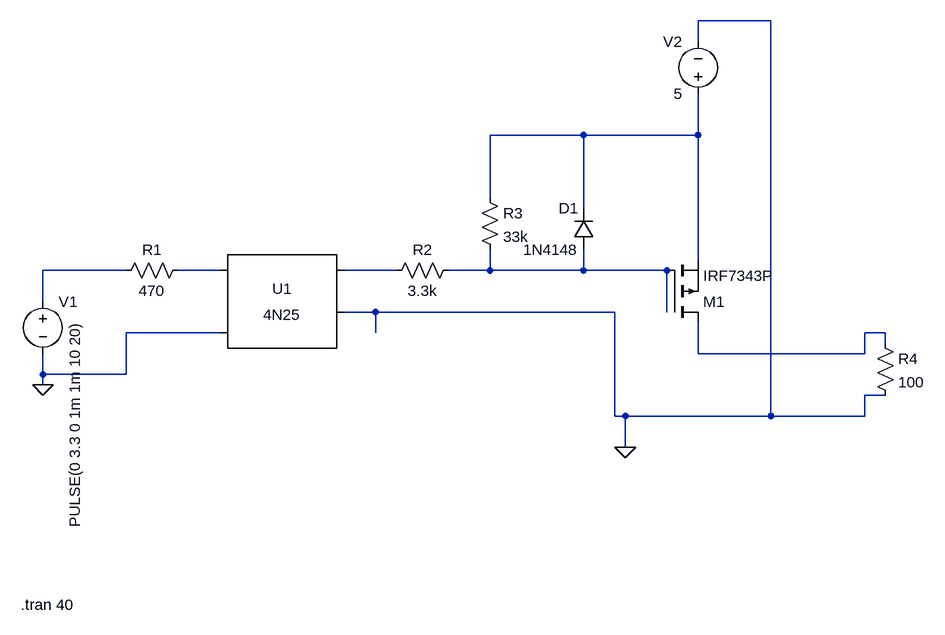
[diagram p0: schematic Draft5.asc]
Draft5.asc, the LTspice schematic file:
Version 4
SHEET 1 1136 680
WIRE 880 -272 768 -272
WIRE 768 -240 768 -272
WIRE 592 -96 448 -96
WIRE 768 -96 768 -160
WIRE 768 -96 592 -96
WIRE 448 0 448 -96
WIRE 592 16 592 -96
WIRE 768 96 768 -96
WIRE -112 112 -240 112
WIRE 32 112 -32 112
WIRE 304 112 224 112
WIRE 448 112 448 80
WIRE 448 112 384 112
WIRE 592 112 592 80
WIRE 592 112 448 112
WIRE 720 112 592 112
WIRE -240 160 -240 112
WIRE 272 176 224 176
WIRE 640 176 272 176
WIRE 720 176 720 112
WIRE 32 208 -112 208
WIRE 272 208 272 176
WIRE 1056 208 1024 208
WIRE 1056 224 1056 208
WIRE 768 240 768 192
WIRE 1024 240 1024 208
WIRE 1024 240 768 240
WIRE -240 272 -240 240
WIRE -112 272 -112 208
WIRE -112 272 -240 272
WIRE -240 288 -240 272
WIRE 1056 304 1024 304
WIRE 640 336 640 176
WIRE 656 336 640 336
WIRE 880 336 880 -272
WIRE 880 336 656 336
WIRE 1024 336 1024 304
WIRE 1024 336 880 336
WIRE 656 384 656 336
FLAG -240 288 0
FLAG 656 384 0
SYMBOL Optos\\4N25 128 176 R0
SYMATTR InstName U1
SYMBOL voltage -240 144 R0
WINDOW 3 49 46 VRight 2
WINDOW 123 0 0 Left 0
WINDOW 39 0 0 Left 0
SYMATTR InstName V1
SYMATTR Value PULSE(0 3.3 0 1m 1m 10 20)
SYMBOL res -16 96 R90
WINDOW 0 0 56 VBottom 2
WINDOW 3 32 56 VTop 2
SYMATTR InstName R1
SYMATTR Value 470
SYMBOL res 400 96 R90
WINDOW 0 0 56 VBottom 2
WINDOW 3 32 56 VTop 2
SYMATTR InstName R2
SYMATTR Value 3.3k
SYMBOL res 432 -16 R0
SYMATTR InstName R3
SYMATTR Value 33k
SYMBOL diode 608 80 R180
WINDOW 0 24 64 Left 2
WINDOW 3 24 0 Left 2
SYMATTR InstName D1
SYMATTR Value 1N4148
SYMBOL pmos 720 192 M180
SYMATTR InstName M1
SYMATTR Value IRF7343P
SYMBOL voltage 768 -144 R180
WINDOW 0 24 96 Left 2
WINDOW 3 24 16 Left 2
SYMATTR InstName V2
SYMATTR Value 5
SYMBOL res 1040 208 R0
SYMATTR InstName R4
SYMATTR Value 100
TEXT -274 626 Left 2 !.tran 40

The netlist it stands for:
* Draft5.asc
XU1 N003 0 N004 0 NC_01 4N25
V1 N002 0 PULSE(0 3.3 0 1m 1m 10 20)
R1 N003 N002 470
R2 N005 N004 3.3k
R3 N001 N005 33k
D1 N005 N001 1N4148
M1 N006 N005 N001 N001 IRF7343P
V2 N001 0 5
R4 N006 0 100
.model D D
.lib standard.dio
.model NMOS NMOS
.model PMOS PMOS
.lib standard.mos
.tran 40
.lib 4N25.sub
.backanno
.end